# EAGLE design TriggerAndCVs_connectors (EAGLE 9.2.1)
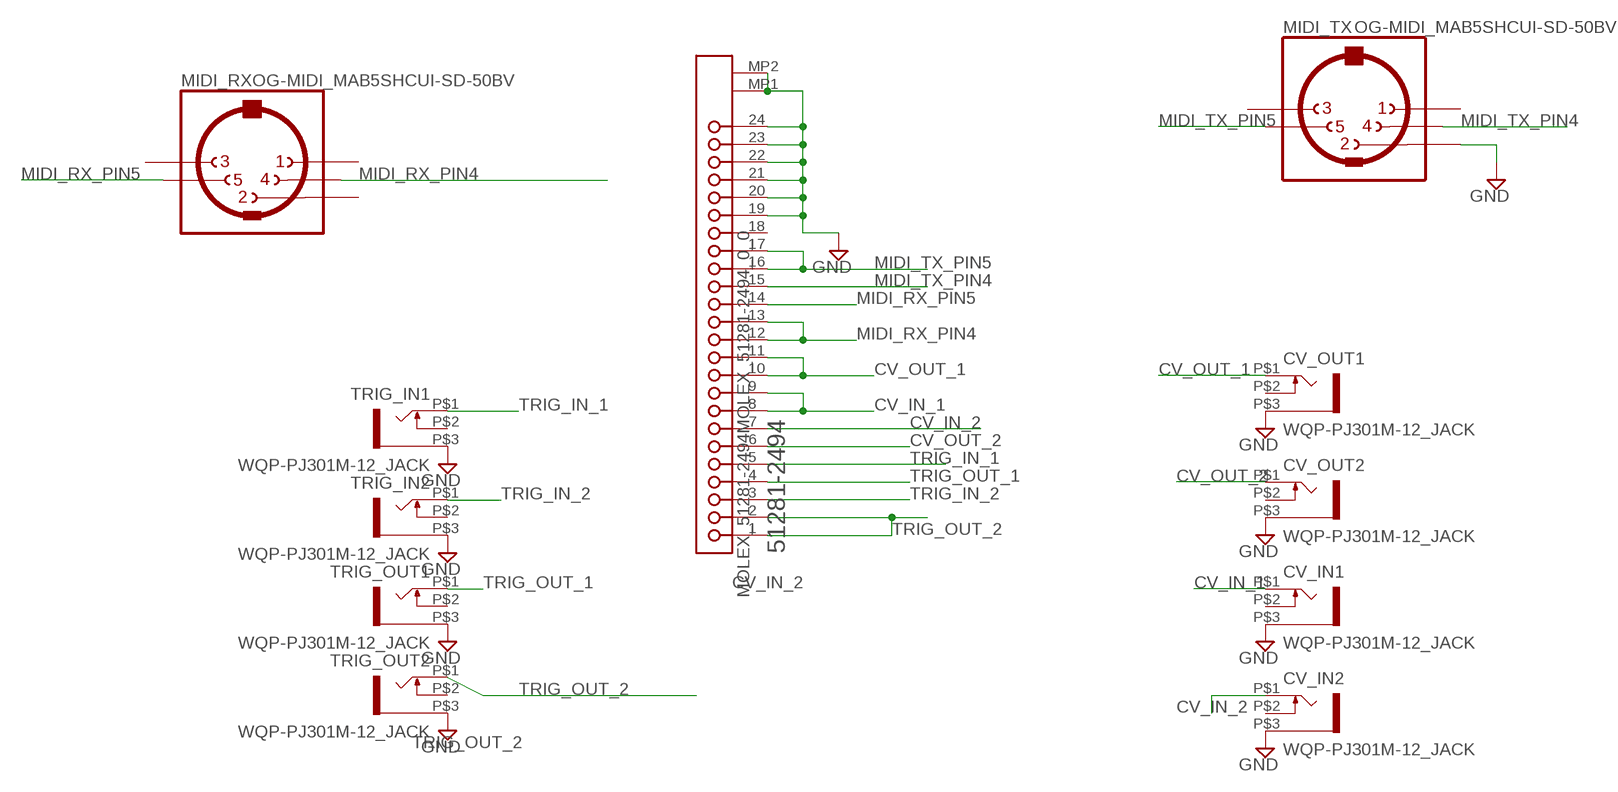
[diagram p0: schematic, sheet 1]

## Parts
CV_IN1  WQP-PJ301M-12_JACK  [WQP-PJ301M-12_JACK]
CV_IN2  WQP-PJ301M-12_JACK  [WQP-PJ301M-12_JACK]
CV_OUT1  WQP-PJ301M-12_JACK  [WQP-PJ301M-12_JACK]
CV_OUT2  WQP-PJ301M-12_JACK  [WQP-PJ301M-12_JACK]
JP4  MOLEX_51281-2494MOLEX_51281-2494_0_0  [MOLEX_51281-2494_0]
MIDI_RX  OG-MIDI_MAB5SHCUI-SD-50BV  [OG-MIDI_SD-50BV]
MIDI_TX  OG-MIDI_MAB5SHCUI-SD-50BV  [OG-MIDI_SD-50BV]
TRIG_IN1  WQP-PJ301M-12_JACK  [WQP-PJ301M-12_JACK]
TRIG_IN2  WQP-PJ301M-12_JACK  [WQP-PJ301M-12_JACK]
TRIG_OUT1  WQP-PJ301M-12_JACK  [WQP-PJ301M-12_JACK]
TRIG_OUT2  WQP-PJ301M-12_JACK  [WQP-PJ301M-12_JACK]

## Nets
CV_IN_1: CV_IN1.P$1 JP4.8 JP4.9
CV_IN_2: CV_IN2.P$1 JP4.7
CV_OUT_1: CV_OUT1.P$1 JP4.10 JP4.11
CV_OUT_2: CV_OUT2.P$1 JP4.6
GND [PWR]: CV_IN1.P$3 CV_IN2.P$3 CV_OUT1.P$3 CV_OUT2.P$3 JP4.19 JP4.20 JP4.21 JP4.22 JP4.23 JP4.24 JP4.MP1 JP4.MP2 MIDI_TX.2 TRIG_IN1.P$3 TRIG_IN2.P$3 TRIG_OUT1.P$3 TRIG_OUT2.P$3
MIDI_RX_PIN4: JP4.12 JP4.13 MIDI_RX.4
MIDI_RX_PIN5: JP4.14 MIDI_RX.5
MIDI_TX_PIN4: JP4.15 MIDI_TX.4
MIDI_TX_PIN5: JP4.16 JP4.17 MIDI_TX.5
TRIG_IN_1: JP4.5 TRIG_IN1.P$1
TRIG_IN_2: JP4.3 TRIG_IN2.P$1
TRIG_OUT_1: JP4.4 TRIG_OUT1.P$1
TRIG_OUT_2: JP4.1 JP4.2 TRIG_OUT2.P$1
Unconnected: CV_IN1.P$2 CV_IN2.P$2 CV_OUT1.P$2 CV_OUT2.P$2 JP4.18 MIDI_RX.1 MIDI_RX.2 MIDI_RX.3 MIDI_TX.1 MIDI_TX.3 TRIG_IN1.P$2 TRIG_IN2.P$2 TRIG_OUT1.P$2 TRIG_OUT2.P$2

## Library data of the parts
CV_IN1 CV_IN2 CV_OUT1 CV_OUT2 TRIG_IN1 TRIG_IN2 TRIG_OUT1 TRIG_OUT2 = thonkiconn:WQP-PJ301M-12_JACK
JP4 = Molex - 51281-2494:MOLEX_51281-2494: MOLX-51281-2494; CIIVA_IDS: 3405321; CIRCUITS_LOADED: 24; COMPONENT_LINK_1_DESCRIPTION: Manufacturer URL; COMPONENT_LINK_1_URL: http://www.molex.com/molex/index.jsp; COMPONENT_LINK_3_DESCRIPTION: Package Specification; COMPONENT_LINK_3_URL: http://www.molex.com/pdm_docs/sd/512812494_sd.pdf; CONTACT_POSITION: Dual; CURRENT_MAX_PER_CONTACT: 0.5A; DATASHEET: http://www.molex.com/webdocs/datasheets/pdf/en-us/0512812494_FFC_FPC_CONNECTORS.pdf; DURABILITY_MATING_CYCLES_MAX: 20; ENTRY_ANGLE: 90degrees Angle; FOOTPRINT_VARIANT_NAME_0: Manufacturer Recommended; IMPORTED: yes; IMPORTED_FROM: vault; IMPORT_TS: 1521850954; MATED_HEIGHT: 1.20mm; MATERIAL___METAL: Phosphor Bronze; MATERIAL___PLATING_MATING: Gold; MATERIAL___PLATING_TERMINATION: Tin; MF: Molex; MOUNTING_TECHNOLOGY: Surface Mount; MPN: 51281-2494; NUMBER_OF_ROWS: 1; ORIENTATION: Right Angle; PACKAGE: 51281-2494; PACKAGE_DESCRIPTION: 24-Lead FPC Connector, Pitch 0.5 mm; PACKAGE_VERSION: Rev. J, 10/2010; PACKING: Tape and Reel; PCB_LOCATOR: No; PCB_RETENTION: Yes; PITCH___MATING_INTERFACE: 0.50mm; POLARIZED_TO_PCB: Yes; PREFIX: J; RELEASE_DATE: 1411372362; ROHS: Yes; STACKABLE: No; VAULT_GUID: 2A86E2F5-7AAB-4DF7-B6C7-A32DC9881D20; VAULT_REVISION: 5B9E9500-2FB9-49B8-84B2-D92C7FEE26D0; VOLTAGE_MAX: 50V
MIDI_RX MIDI_TX = midi-connectors:OG-MIDI_MAB5SH: Female CONNECTOR 5 pins 90 deg. with shield, horizontal (DIN 41524)

## Net classes
1 PWR: width 0.457 mm, clearance 0.203 mm

## Board
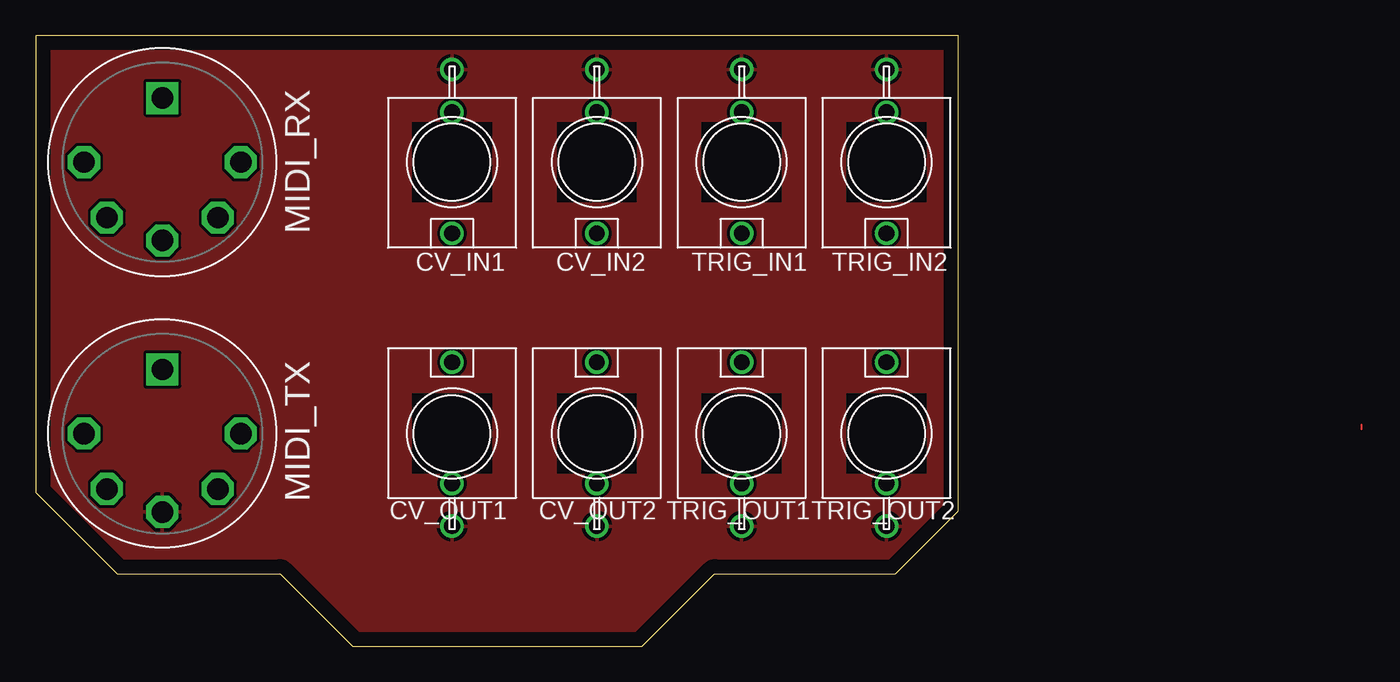
[diagram p1: board, top side]
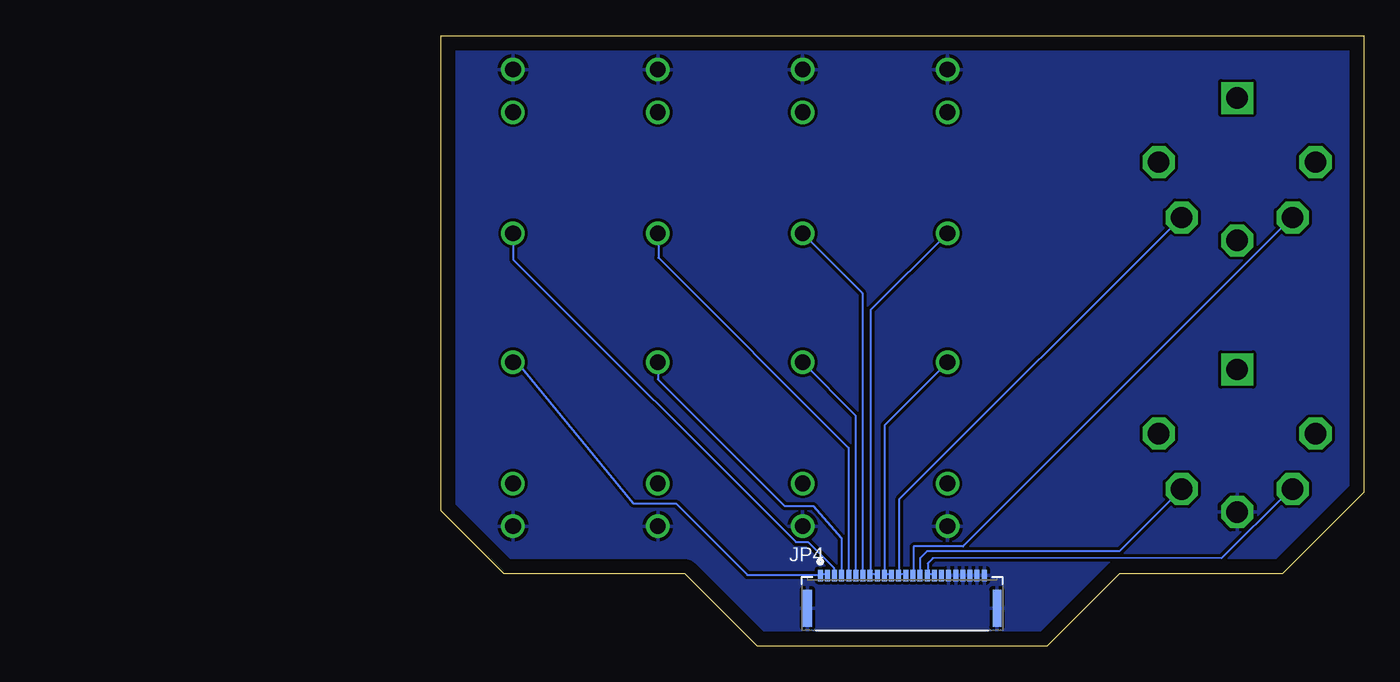
[diagram p2: board, bottom side, seen from below]

Size 64.75 x 42.85 mm. Coordinates in mm from the lower left corner, seen from the top.
Outline: 0,42.85 0,10.79 5.72,5.08 17.15,5.08 22.23,0 42.55,0 47.63,5.08 60.32,5.08 64.75,9.5 64.75,42.85 0,42.85
Copper layers (1*16): Top 0.035mm / dielectric 1.5mm / Bottom 0.035mm
Design rules "default *": minimum track width 6mil, minimum drill 0.35mm, track to track 1mil, track to pad 1mil, pad to pad 1mil, via to via 1mil, smd to smd 1mil, copper to edge 40mil, drill to drill 6mil, minimum pad ring 10mil, minimum via ring 8mil, stop-mask expansion 4mil, vias tented up to drill 0mil, thermal gap 10mil

### Footprints (pad centres in the part's own frame; a part is rotated, then mirrored left to right if it is on the bottom)
WQP-PJ301M-12_JACK = drill 1.1: P$1 0,5; P$2 0,-3.5; P$3 0,-6.5
MOLEX_51281-2494_0 = smd 0.35 x 0.8: 1 -5.75,1.15; 2 -5.25,1.15; 3 -4.75,1.15; 4 -4.25,1.15; 5 -3.75,1.15; 6 -3.25,1.15; 7 -2.75,1.15; 8 -2.25,1.15; 9 -1.75,1.15; 10 -1.25,1.15; 11 -0.75,1.15; 12 -0.25,1.15; 13 0.25,1.15; 14 0.75,1.15; 15 1.25,1.15; 16 1.75,1.15; 17 2.25,1.15; 18 2.75,1.15; 19 3.25,1.15; 20 3.75,1.15; 21 4.25,1.15; 22 4.75,1.15; 23 5.25,1.15; 24 5.75,1.15 | smd 0.6 x 2.6: MP1 -6.65,-1.15; MP2 6.65,-1.15
OG-MIDI_SD-50BV = drill 1.5 octagon: 1 -5.5,0; 2 0,5.5; 3 5.5,0; 4 -3.89,3.89; 5 3.89,3.89 | drill 1.5 square: P$3 0,-4.5

### Placement (x,y rotation side)
CV_IN1  29.21,33.97 180 top
CV_IN2  39.37,33.97 180 top
CV_OUT1  29.21,14.92 0 top
CV_OUT2  39.37,14.92 0 top
JP4  32.38,3.81 0 bottom
MIDI_RX  8.89,33.97 180 top
MIDI_TX  8.89,14.92 180 top
TRIG_IN1  49.53,33.97 180 top
TRIG_IN2  59.69,33.97 180 top
TRIG_OUT1  49.53,14.92 0 top
TRIG_OUT2  59.69,14.92 0 top

### Tracks (layer width: path | path; a pad name or v marks a point on that pad's centre or on a via)
CV_IN_1
  Bottom 0.152: CV_IN1.P$1 29.22,28.96 34.6,23.58 34.6,5 JP4.8 34.61,5.08 34.29,5.08 JP4.9
CV_IN_2
  Bottom 0.152: JP4.7 35.18,5 35.18,24.78 CV_IN2.P$1
CV_OUT_1
  Bottom 0.152: CV_OUT1.P$1 29.22,19.89 33.62,15.49 33.62,5 JP4.10 33.5,5.08 33.18,5.08 JP4.11
CV_OUT_2
  Bottom 0.152: JP4.6 35.67,5 35.67,16.21 39.36,19.89 CV_OUT2.P$1
GND
  pour Top: -8.25,36.83 -1.9,43.18 -1.9,44.45 64.77,44.45 77.47,31.75 77.47,20.32 55.24,-1.9 7.62,-1.9 -12.06,17.78 -12.06,33.02
  pour Bottom: -12.06,33.02 -0.63,44.45 0.64,44.45 64.77,44.45 77.47,31.75 77.47,20.32 55.24,-1.9 7.62,-1.9 -12.06,17.78
MIDI_RX_PIN4
  Bottom 0.152: MIDI_RX.4 12.82,30.07 32.6,10.29 32.6,5 JP4.12 32.54,5.08 32.23,5.08 JP4.13
MIDI_RX_PIN5
  Bottom 0.152: JP4.14 31.62,5 31.62,5.23 31.59,5.23 31.59,7 28.12,7 5.04,30.07 MIDI_RX.5
MIDI_TX_PIN4
  Bottom 0.152: JP4.15 31.13,5 31.13,6.18 30.65,6.66 17.16,6.66 12.82,11 MIDI_TX.4
MIDI_TX_PIN5
  Bottom 0.152: MIDI_TX.5 5.39,10.78 9.97,6.19 30.24,6.17 30.6,5.81 30.6,5 JP4.16 30.48,5.08 30.16,5.08 JP4.17
N$9
  Top 0.152: 93.03,15.24 93.03,15.56
TRIG_IN_1
  Bottom 0.152: JP4.5 36.16,5 36.16,13.93 49.49,27.27 49.49,28.96 TRIG_IN1.P$1
TRIG_IN_2
  Bottom 0.152: JP4.3 37.18,4.96 37.18,5.49 39,7.31 39.85,7.31 59.67,27.14 59.67,28.96 TRIG_IN2.P$1
TRIG_OUT_1
  Bottom 0.152: TRIG_OUT1.P$1 49.53,18.73 40.64,9.84 38.63,9.84 36.65,7.57 36.65,5 JP4.4
TRIG_OUT_2
  Bottom 0.152: TRIG_OUT2.P$1 59.67,19.89 59.4,19.89 51.28,10.03 48.27,10.01 43.25,5 38.16,5 JP4.1 38.1,5.08 37.78,5.08 JP4.2